# Altium schematic sheet sheet2.schdoc
size A3; PageSetup: Record=PageOptions|CenterHorizontal=True|CenterVertical=True|PrintScale=1.00|XCorrection=1.00|YCorrection=1.00|PrintKind=1|BorderSize=5000000|LeftOffset=0|BottomOffset=0|Orientation=2|PaperLength=1000|PaperWidth=1000|Scale=100|PaperSource=7|PrintQuality=-3|MediaType=1|DitherType=10|PrintScaleMode=1|PaperKind=A3|PaperIndex=8
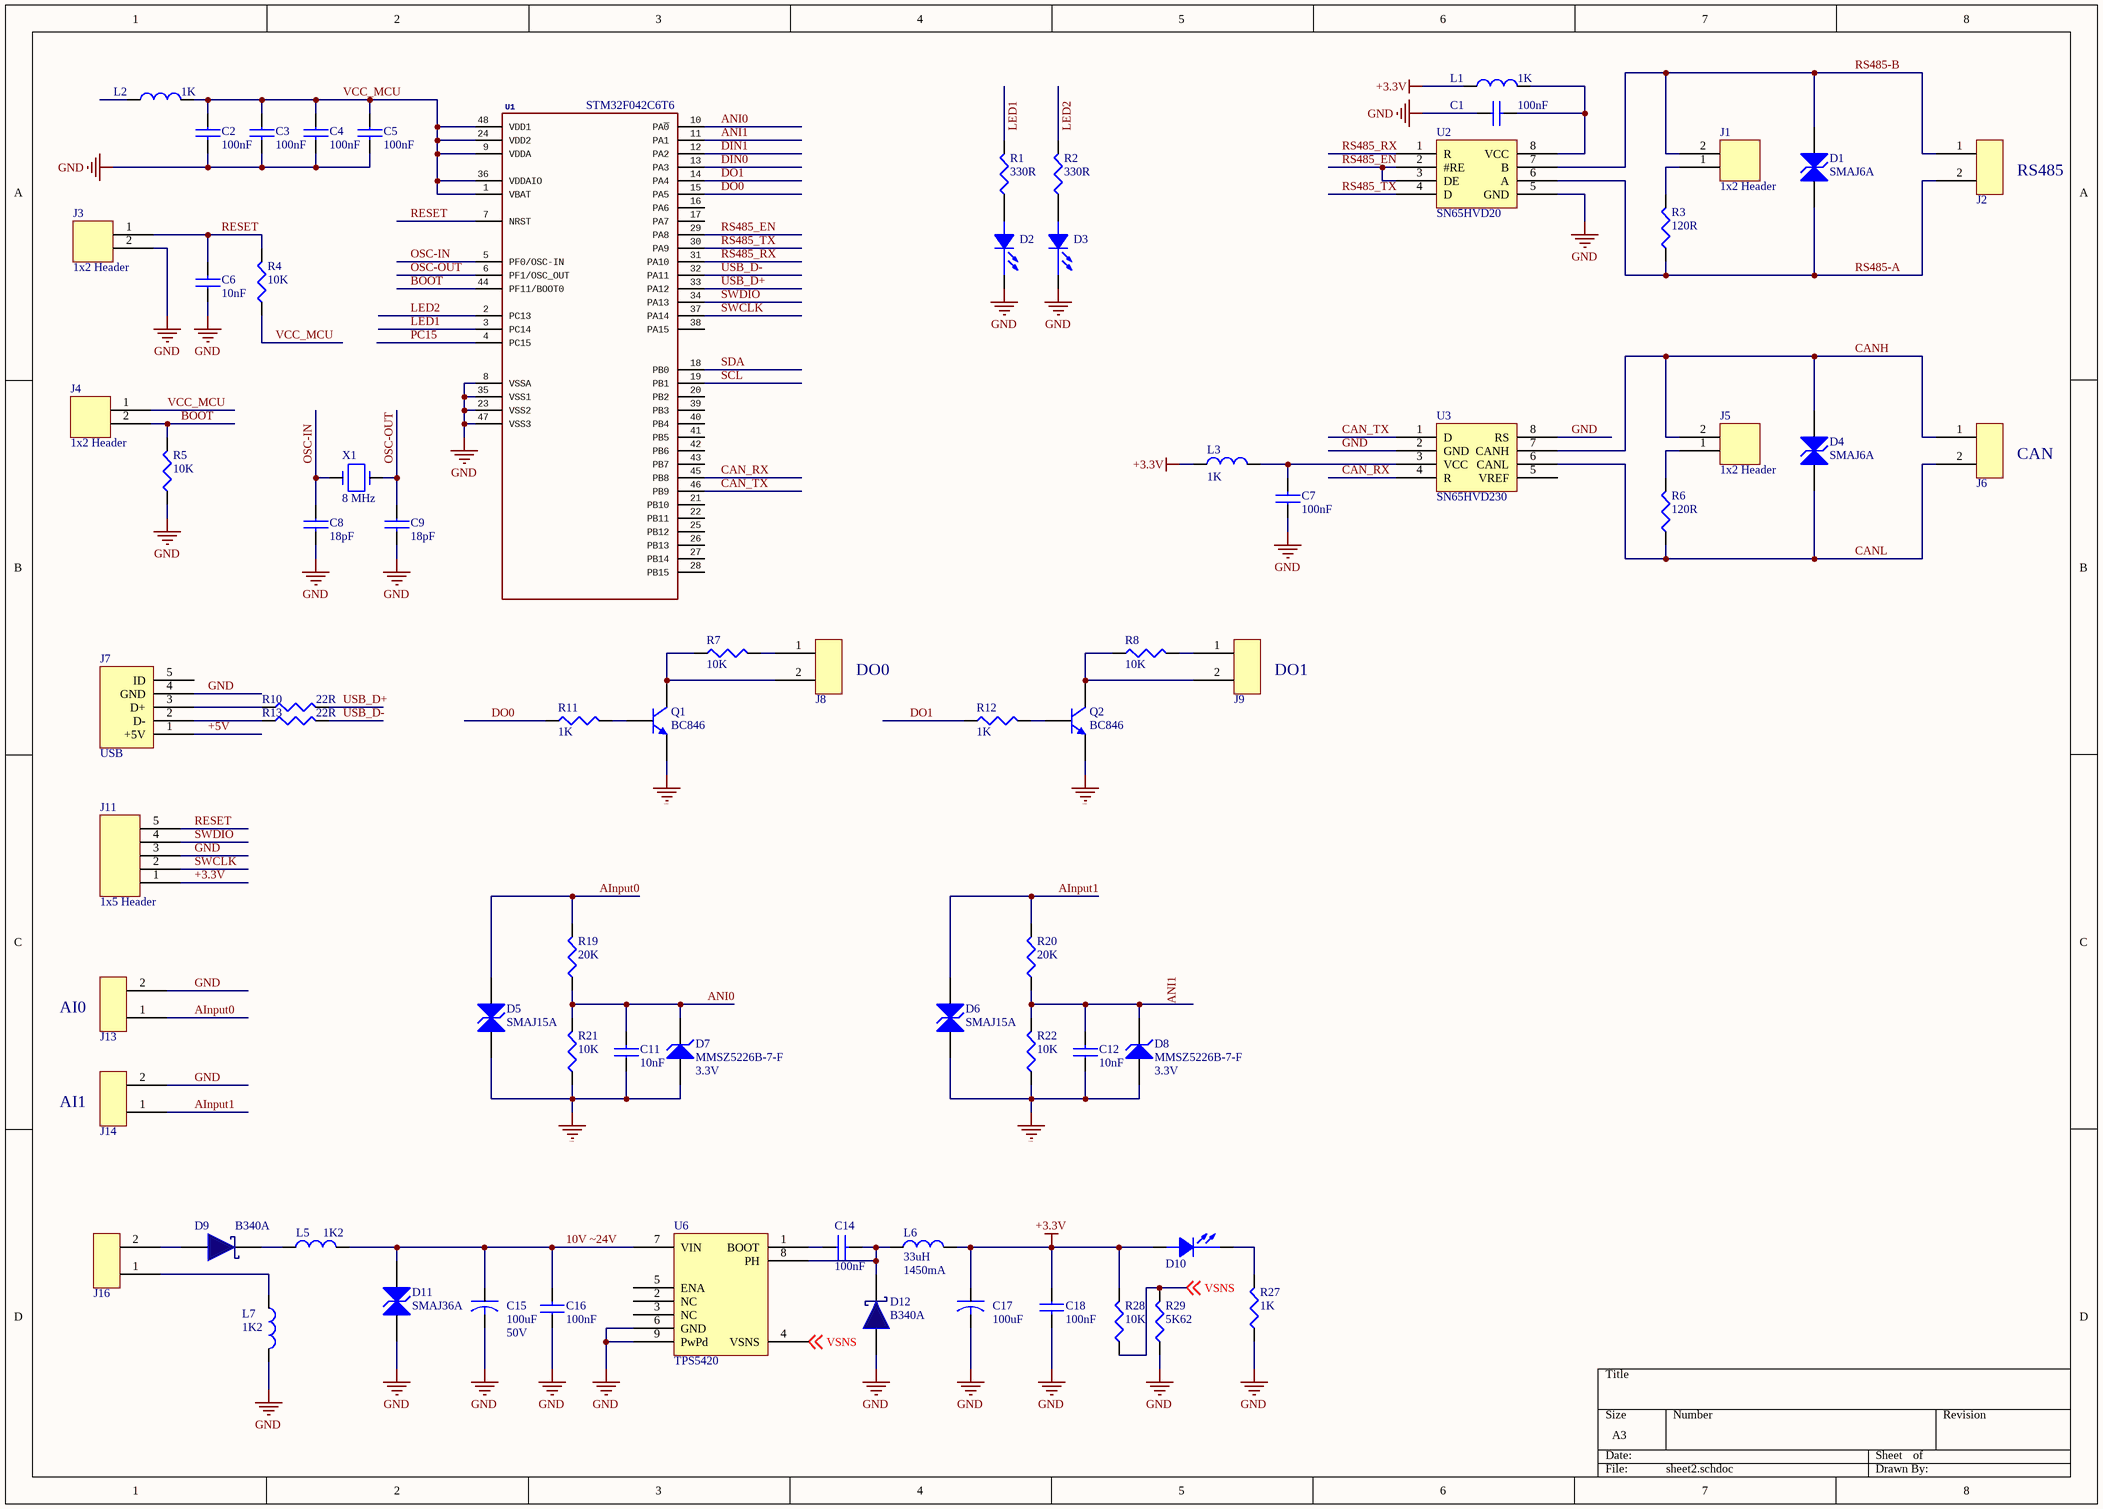
[diagram p0: sheet2.schdoc]

## Parts
C1  value 100nF  [0805 SMD Ceramic Capacitor]  (hidden comment: C0805C104)
C2  value 100nF  [0805 SMD Ceramic Capacitor]  (hidden comment: C0805C104)
C3  value 100nF  [0805 SMD Ceramic Capacitor]  (hidden comment: C0805C104)
C4  value 100nF  [0805 SMD Ceramic Capacitor]  (hidden comment: C0805C104)
C5  value 100nF  [0805 SMD Ceramic Capacitor]  (hidden comment: C0805C104)
C6  value 10nF  [0805 SMD Ceramic Capacitor]  (hidden comment: C0805C103)
C7  value 100nF  [0805 SMD Ceramic Capacitor]  (hidden comment: C0805C104)
C8  value 18pF  [0805 SMD Ceramic Capacitor]  (hidden comment: C0805C180)
C9  value 18pF  [0805 SMD Ceramic Capacitor]  (hidden comment: C0805C180)
C11  value 10nF  [0805 SMD Ceramic Capacitor]  (hidden comment: C0805C103)
C12  value 10nF  [0805 SMD Ceramic Capacitor]  (hidden comment: C0805C103)
C14  value 100nF  [0805 SMD Ceramic Capacitor]  (hidden comment: C0805C104)
C15  value 100uF  Voltage: 50V  [150CLZ1010]  (hidden comment: 100uF/50V Electrolitic)
C16  value 100nF  [0805 SMD Ceramic Capacitor]  (hidden comment: C0805C104)
C17  value 100uF  [D Case]  (hidden comment: T491D107)
C18  value 100nF  [0805 SMD Ceramic Capacitor]  (hidden comment: C0805C104)
D1  SMAJ6A  [SMA]
D2  LED  [1206]  (value not drawn)
D3  LED  [1206]  (value not drawn)
D4  SMAJ6A  [SMA]
D5  SMAJ15A  [SMA]
D6  SMAJ15A  [SMA]
D7  value 3.3V  [SOD-123]  (hidden comment: MMSZ5226B-7-F)
D8  value 3.3V  [SOD-123]  (hidden comment: MMSZ5226B-7-F)
D9  B340A  [SMB]
D10  LED  [1206]  (value not drawn)
D11  SMAJ36A  [SMA]
D12  B340A  [SMB]
J1  value 1x2 Header  [1x2 2 Pin Header]  (hidden comment: 1x2 2 Pin Header)
J2  2x Terminal  [2x Terminal mini]  (value not drawn)
J3  value 1x2 Header  [1x2 2 Pin Header]  (hidden comment: 1x2 2 Pin Header)
J4  value 1x2 Header  [1x2 2 Pin Header]  (hidden comment: 1x2 2 Pin Header)
J5  value 1x2 Header  [1x2 2 Pin Header]  (hidden comment: 1x2 2 Pin Header)
J6  2x Terminal  [2x Terminal mini]  (value not drawn)
J7  value USB  [Mini USB B]  (hidden comment: USB_B)
J8  2x Terminal  [2x Terminal mini]  (value not drawn)
J9  2x Terminal  [2x Terminal mini]  (value not drawn)
J11  value 1x5 Header  [1x5 5 Pin Header]  (hidden comment: 1x5 5 Pin Header)
J13  2x Terminal  [2x Terminal mini]  (value not drawn)
J14  2x Terminal  [2x Terminal mini]  (value not drawn)
J16  2x Terminal  [2x Terminal mini]  (value not drawn)
L1  value 1K  [0805 Inductor]  (hidden comment: 0805Ferrite)
L2  value 1K  [0805 Inductor]  (hidden comment: 0805Ferrite)
L3  value 1K  [0805 Inductor]  (hidden comment: 0805Ferrite)
L5  value 1K2  [1206 Inductor]  (hidden comment: 1206Ferrite)
L6  value 33uH  Current: 1450mA  [Power Inductor]  (hidden comment: 33uH_1450mA)
L7  value 1K2  [1206 Inductor]  (hidden comment: 1206Ferrite)
Q1  BC846  [SOT23]
Q2  BC846  [SOT23]
R1  value 330R  [0805 Resistor]  (hidden comment: 0805_330R)
R2  value 330R  [0805 Resistor]  (hidden comment: 0805_330R)
R3  value 120R  [0805 Resistor]  (hidden comment: 0805_120R)
R4  value 10K  [0805 Resistor]  (hidden comment: 0805_10K)
R5  value 10K  [0805 Resistor]  (hidden comment: 0805_10K)
R6  value 120R  [0805 Resistor]  (hidden comment: 0805_120R)
R7  value 10K  [0805 Resistor]  (hidden comment: 0805_10K)
R8  value 10K  [0805 Resistor]  (hidden comment: 0805_10K)
R10  value 22R  [0805 Resistor]  (hidden comment: 0805_22R%1)
R11  value 1K  [0805 Resistor]  (hidden comment: 0805_1K)
R12  value 1K  [0805 Resistor]  (hidden comment: 0805_1K)
R13  value 22R  [0805 Resistor]  (hidden comment: 0805_22R%1)
R19  value 20K  [0805 Resistor]  (hidden comment: 0805_20K)
R20  value 20K  [0805 Resistor]  (hidden comment: 0805_20K)
R21  value 10K  [0805 Resistor]  (hidden comment: 0805_10K)
R22  value 10K  [0805 Resistor]  (hidden comment: 0805_10K)
R27  value 1K  [0805 Resistor]  (hidden comment: 0805_1K)
R28  value 10K  [0805 Resistor]  (hidden comment: 0805_10K)
R29  value 5K62  [0805 Resistor]  (hidden comment: 0805_5K62%1)
U1  value STM32F042C6T6  [LQFP-48]  (hidden comment: *)
U2  SN65HVD20  [SO8]
U3  SN65HVD230  [SO8]
U6  TPS5420  [DDA8]
X1  value 8 MHz  [SMD Crystal]  (hidden comment: SMD XTAL 8MHz)

## Nets
+3.3V: C17.1 C18.1 D10.1(ANODE) J11.1 L1.1 L3.1 L6.2 R28.2
GND: C1.1 C2.2 C3.2 C4.2 C5.2 C6.1 C7.1 C8.2 C9.2 C11.1 C12.1 C15.2 C16.1 C17.2 C18.2 D2.2(CATHODE) D3.2(CATHODE) D5.1(A) D6.1(A) D7.2(A) D8.2(A) D11.1(A) D12.2 J3.2 J7.4(GND) J11.3 J13.2 J14.2 L7.2 Q1.2(E) Q2.2(E) R5.1 R21.1 R22.1 R27.1 R29.1 U1.8(VSSA) U1.23(VSS2) U1.35(VSS1) U1.47(VSS3) U2.5(GND) U3.2(GND) U3.8(RS) U6.6(GND) U6.9(PwPd)
10V ~24V: C15.1 C16.2 D11.2(K) L5.2 U6.7(VIN)
+5V: J7.1(+5V)
AInput0: D5.2(K) J13.1 R19.2
AInput1: D6.2(K) J14.1 R20.2
ANI0: C11.2 D7.1(K) R19.1 R21.2 U1.10(PA~{0})
ANI1: C12.2 D8.1(K) R20.1 R22.2 U1.11(PA1)
BOOT: J4.2 R5.2 U1.44(PF11/BOOT0)
CAN_RX: U1.45(PB8) U3.4(R)
CAN_TX: U1.46(PB9) U3.1(D)
CANH: D4.2(K) J5.2 J6.1 U3.7(CANH)
CANL: D4.1(A) J6.2 R6.1 U3.6(CANL)
DIN0: U1.13(PA3)
DIN1: U1.12(PA2)
DO0: R11.1 U1.15(PA5)
DO1: R12.1 U1.14(PA4)
LED1: R1.2 U1.3(PC14)
LED2: R2.2 U1.2(PC13)
OSC-IN: C8.1 U1.5(PF0/OSC-IN) X1.2
OSC-OUT: C9.1 U1.6(PF1/OSC_OUT) X1.1
PC15: U1.4(PC15)
RESET: C6.2 J3.1 J11.5 R4.2 U1.7(NRST)
RS485-A: D1.1(A) J2.2 R3.1 U2.6(A)
RS485-B: D1.2(K) J1.2 J2.1 U2.7(B)
RS485_EN: U1.29(PA8) U2.2(#RE) U2.3(DE)
RS485_RX: U1.31(PA10) U2.1(R)
RS485_TX: U1.30(PA9) U2.4(D)
SCL: U1.19(PB1)
SDA: U1.18(PB0)
SWCLK: J11.2 U1.37(PA14)
SWDIO: J11.4 U1.34(PA13)
USB_D+: R10.2 U1.33(PA12)
USB_D-: R13.2 U1.32(PA11)
VCC_MCU: C2.1 C3.1 C4.1 C5.1 J4.1 L2.2 R4.1 U1.1(VBAT) U1.9(VDDA) U1.24(VDD2) U1.36(VDDAIO) U1.48(VDD1)
VSNS: R28.1 R29.2 U6.4(VSNS) ; off-sheet VSNS
NetC1_2: C1.2 L1.2 U2.8(VCC)
NetC7_2: C7.2 L3.2 U3.3(VCC)
NetC14_1: C14.1 U6.1(BOOT)
NetC14_2: C14.2 D12.1 L6.1 U6.8(PH)
NetD2_1: D2.1(ANODE) R1.1
NetD3_1: D3.1(ANODE) R2.1
NetD9_1: D9.1 L5.1
NetD9_2: D9.2 J16.2
NetD10_2: D10.2(CATHODE) R27.2
NetJ1_1: J1.1 R3.2
NetJ5_1: J5.1 R6.2
NetJ7_2: J7.2(D-) R13.1
NetJ7_3: J7.3(D+) R10.1
NetJ8_1: J8.1 R7.2
NetJ8_2: J8.2 Q1.3(C) R7.1
NetJ9_1: J9.1 R8.2
NetJ9_2: J9.2 Q2.3(C) R8.1
NetJ16_1: J16.1 L7.1
NetQ1_1: Q1.1(B) R11.2
NetQ2_1: Q2.1(B) R12.2

Not connected (* = marked no-connect by the designer): J7 5(ID); L2 1; U1 16(PA6) 17(PA7) 20(PB2) 21(PB10) 22(PB11) 25(PB12) 26(PB13) 27(PB14) 28(PB15) 38(PA15) 39(PB3) 40(PB4) 41(PB5) 42(PB6) 43(PB7); U3 5(VREF); U6 2(NC) 3(NC) 5(ENA)

## Notes on the sheet
- (near J2) RS485
- (near J6) CAN
- (near J8) DO0
- (near J9) DO1
- (near J13) AI0
- (near J14) AI1

## Library data of the parts
C1-C5 C7 C14 C16 C18 = C0805C104: Manufacturer Code: C0805C104J5RACTU; Manufacturer: KEMET; Voltage: 50V; Farnell Code: 1414663; Unit Price: 0,06 €; Package: 0805
C6 C11 C12 = C0805C103: Manufacturer: KEMET; Manufacturer Code: C0805C103J3GACTU; Voltage: 25V; Temp. Coefficient: ±30ppm/°C; Tolerance: ±5%; Farnell Code: 1457736; Unit Price: 0,64 €; Package: 0805
C8 C9 = C0805C180: Manufacturer Code: C0805C180J5GACTU; Manufacturer: KEMET; Voltage: 50V; Farnell Code: 1414673; Unit Price: 0,038 €; Package: 0805
C15 = 100uF/50V Electrolitic: Manufacturer: Vishay; Manufacturer Code: 222215097101; Farnell Code: 1838778; Unit Price: 0,94 €
C17 = T491D107: Manufacturer Code: T491D107K010AT; Manufacturer: KEMET; Voltage: 10V; Farnell Code: 1457492; Unit Price: 0,47 €
D1 D4 = SMAJ6A: Manufacturer: MULTICOMP; Manufacturer Code: SMAJ6.0A; Voltage: 6V; Farnell Code: 1579007; Unit Price: 0,24 €; Value: SMAJ6A
D2 D3 D10 = LED: Manufacturer Code: LGN971; Manufacturer: OSRAM; Value: Green; Farnell Code: 1226371; Unit Price: 0,127 €
D5 D6 = SMAJ15A: Manufacturer: Littlefuse Inc.; Voltage: 12V; Manufacturer Code: SMAJ15A; Unit Price: 0,35$; Value: SMAJ15A
D7 D8 = MMSZ5226B-7-F: Manufacturer: Diodes Incorporated; Unit Price: 0.19$; Manufacturer Code: MMSZ5226B-7-F
D9 D12 = B340A: Manufacturer Code: B340A-13-F; Manufacturer: DIODES INC.; Voltage: 40V; Forward Current: 3A; Unit Price: 0,42$; Value: B340A
D11 = SMAJ36A: Manufacturer: Littlefuse Inc.; Voltage: 12V; Manufacturer Code: SMAJ36A; Unit Price: 0,38$; Value: SMAJ36A
J2 J6 J8 J9 J13 J14 J16 = 2x Terminal: Manufacturer: WEIDMULLER; Manufacturer Code: PM5.08/2/90 BLK; Value: 2x Terminal; Farnell Code: 1131855; Unit Price: 0,55 €
J7 = USB_B: Manufacturer: MULTICOMP; Manufacturer Code: MC32598; Farnell Code: 1696539; Unit Price: 1,07 €
L1-L3 = 0805Ferrite: Manufacturer Code: MMZ2012R102A; Manufacturer: TDK; Current: 500mA; Farnell Code: 1669719; Unit Price: 0,059 €
L5 L7 = 1206Ferrite: Manufacturer Code: MLB-321611-1200PL; Manufacturer: MEC MARCOM; Current: 1A; Farnell Code: 1308794; Unit Price: 0,30 €
L6 = 33uH_1450mA: Manufacturer: Murata Power Solutions; Manufacturer Code: 46333C; Unit Price: 0,67; Farnell Code: 2062833
Q1 Q2 = BC846: Manufacturer: NXP Semiconductors; Voltage: 65V; Farnell Code: 1081227; Manufacturer Code: BC846; Unit Price: 0,049 €; Value: BC846
R1 R2 = 0805_330R: Manufacturer Code: MC 0.1W 0805 1% 330R; Manufacturer: MULTICOMP; Tolerance: ±1%; Farnell Code: 9333037; Unit Price: 0,03 €
R3 R6 = 0805_120R: Manufacturer Code: MC 0.1W 0805 1% 120R; Manufacturer: MULTICOMP; Tolerance: ±1%; Farnell Code: 9332480; Unit Price: 0,03 €
R4 R5 R7 R8 R21 R22 R28 = 0805_10K: Manufacturer Code: MC 0.1W 0805 1% 10K; Manufacturer: MULTICOMP; Tolerance: ±1%; Farnell Code: 9332391; Unit Price: 0,03 €
R10 R13 = 0805_22R%1: Manufacturer Code: MC01W0805122R; Manufacturer: MULTICOMP; Tolerance: ±1%; Farnell Code: 9332847; Unit Price: 0,02 €; MOQ: 10
R11 R12 R27 = 0805_1K: Manufacturer Code: MC01W080511K; Manufacturer: MULTICOMP; Tolerance: ±1%; Farnell Code: 9332383; Unit Price: 0,03 €
R19 R20 = 0805_20K: Manufacturer Code: MC 0.1W 0805 1% 20K; Manufacturer: MULTICOMP; Tolerance: ±1%; Farnell Code: 9332774; Unit Price: 0,03 €
R29 = 0805_5K62%1: Manufacturer Code: CRCW08055K62FKEA; Manufacturer: VISHAY DRALORIC; Tolerance: ±1%; Farnell Code: 1469942; Unit Price: 0,018 €
U1 = STM32F042C6T6: Manufacturer: ST Microelectronics; Unit Price: 2,94$; Manufacturer Code: STM32F042C6T6; DeviceSetName: STM32F042C6T6
U2 = SN65HVD20: Manufacturer: Texas Instruments; Manufacturer Code: SN65HVD20D; Unit Price: 3,56 €; Farnell Code: 1212361; Value: SN65HVD20
U3 = SN65HVD230: Manufacturer: Texas Instruments; Manufacturer Code: SN65HVD230D; Unit Price: 2,77$; Value: SN65HVD230
U6 = TPS5420: Manufacturer: Texas Instruments; Manufacturer Code: TPS5420DG4; Farnell Code: 1262365; Unit Price: 4,99 €; Value: TPS5420
X1 = SMD XTAL 8MHz: Manufacturer: Abracon LLC; Manufacturer Code: ABLS-8.000MHZ-B4-T; Frequency Stability: ±50ppm; Frequency Tolerance: ±30ppm; Load Capacitance: 18pF; Operating Mode: Fundamental; Supplier 1: Digi-Key; RoHS: RoHS Compliant; Category: Crystals, Oscillators, Resonators; Stock 1: 24477; Pricing 1: 1=0.25, 10=0.209, 50=0.1882, 100=0.1672, 500=0.15884 (USD); Packaging: Cut Tape (CT); Part Status: Active; Type: MHz Crystal; Operating Temperature: -20°C ~ 70°C; Ratings: -; Mounting Type: Surface Mount; Package / Case: HC-49/US; Size / Dimension: 0.449" L x 0.185" W (11.40mm x 4.70mm); Height - Seated (Max): 0.165" (4.20mm); ComponentLink1URL: https://abracon.com/Resonators/abls.pdf; ComponentLink1Description: https://abracon.com/Resonators/abls.pdf; Supplier Part Number 1: 535-10212-1-ND; Unit Price: 0,25$